# Altium project Nano_pro.PrjPcb
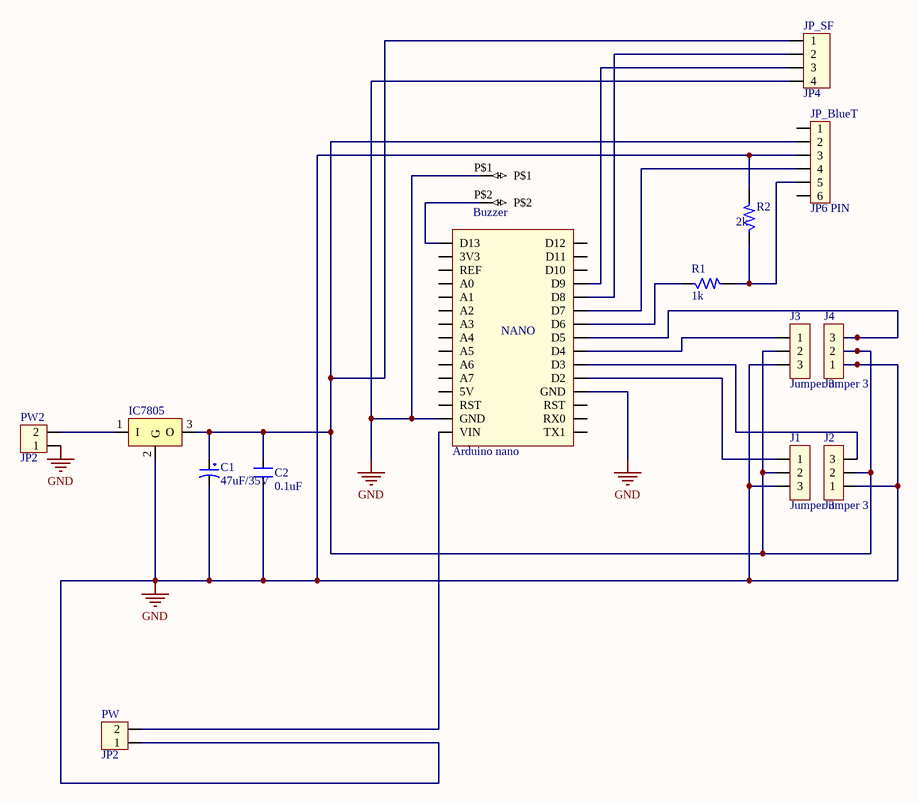
[diagram p0: Nano_pro.SchDoc]
1 sheet, 15 parts. Net scope: global (net labels, ports and power ports of the same name join across sheets).
Board file: Nano_pro.PcbDoc

## Sheet Nano_pro.SchDoc
size A

### Parts
Arduino_nano  Arduino Nano  [Arduino Nano]  (value not drawn)
Buzzer  PT-1340P-P10-PQ  [*PT-1340_PT-1340P-P10-PQ(Primary)]  (value not drawn)
C1  47uF/35V  [CP1.5/3.4]
C2  0.1uF  [SM-CAP-0805]
IC7805  LM78xx  [TO220NH]  (value not drawn)
J1  Jumper 3  [CON3]
J2  Jumper 3  [CON3]
J3  Jumper 3  [CON3]
J4  Jumper 3  [CON3]
JP_BlueT  JP6 PIN  [CON6]
JP_SF  JP4  [CON4]
PW  JP2  [CON2]
PW2  JP2  [CON2]
R1  1k  [SM-RES-0805]
R2  2k  [SM-RES-0805]

### Nets
GND: Arduino_nano.GND Buzzer.P$1 C1.2 C2.1 IC7805.2(G) J1.3 J2.1 J3.3 J4.1 JP_BlueT.3 JP_SF.4 PW.1 PW2.1 R2.2
NetArduino_nano_D2: Arduino_nano.D2 J1.1
NetArduino_nano_D3: Arduino_nano.D3 J2.3
NetArduino_nano_D4: Arduino_nano.D4 J3.1
NetArduino_nano_D5: Arduino_nano.D5 J4.3
NetArduino_nano_D6: Arduino_nano.D6 R1.1
NetArduino_nano_D7: Arduino_nano.D7 JP_BlueT.4
NetArduino_nano_D8: Arduino_nano.D8 JP_SF.2
NetArduino_nano_D9: Arduino_nano.D9 JP_SF.3
NetArduino_nano_D13: Arduino_nano.D13 Buzzer.P$2
NetArduino_nano_VIN: Arduino_nano.VIN PW.2
NetC1_1: C1.1 C2.2 IC7805.3(O) J1.2 J2.2 J3.2 J4.2 JP_BlueT.2 JP_SF.1
NetIC7805_1: IC7805.1(I) PW2.2
NetJP_BlueT_5: JP_BlueT.5 R1.2 R2.1

Not connected (* = marked no-connect by the designer): Arduino_nano 3V3 5V A0 A1 A2 A3 A4 A5 A6 A7 D10 D11 D12 REF RST RX0 TX1; JP_BlueT 1 6

### Notes on the sheet
- (in symbol Arduino Nano) NANO

### Library data of the parts
Arduino_nano = Arduino Nano: Value: Cau 1A
C1 = CP3: Cap 100uF/35V - 470uF/16V; Value: 100uF/35V/50V; Description 1: 1000uF/6,3V - 470uF/16V - 330uF - 25V; Description 2: 220uF/35V - 100uF/50V - 63V - 4,7uF/200V; Description 3: 22uF => 33uF100V - 3,3uF => 4,7uF/250V; Description 4: 2,2uF =>3,3uF/350 - 2,2uF/400V - 1uF/450V
C2 = CM: Cap SMD; Value: 103
IC7805 = LM78xx: Positive Voltage Regulator; Note: Tab is connected to pin 3 (GND).; Published: 24-Aug-2001; LatestRevisionDate: 17-Jul-2002; LatestRevisionNote: Re-released for DXP Platform.; DatasheetVersion: Apr-1994; PackageVersion: Jul-1998; PackageReference: ISOWATT220AB; Publisher: Altium Limited; PackageDescription: TO, Thru-Hole, Vertical, Heatsink Mounted; 3 In-Line Leads; Pitch 2.54 mm; Pin sequence 1, 3, 2; ComponentLink1Description: Manufacturer Link; ComponentLink1URL: http://www.st.com/; ComponentLink2Description: Datasheet; ComponentLink2URL: http://www.st.com/stonline/products/literature/ds/2146/l78m05c.pdf
J1-J4 = JP3: Value: J3
JP_BlueT = JP6: Value: JP7
JP_SF = Con4: Connector 4; Value: Connector 4
PW PW2 = Con2: Connector 2; Value: Connector 2
R1 R2 = R: Resistor 1/4W; Value: R1/4W - 1K
Buzzer = PT-1340P-P10-PQ: SnapEDA_Link: https://www.snapeda.com/parts/PT-1340P-P10-PQ/Mallory%20Sonalert%20Products%20Inc./view-part/463109/?ref=snap; Value: *